# Altium schematic sheet rio.SchDoc
size A4
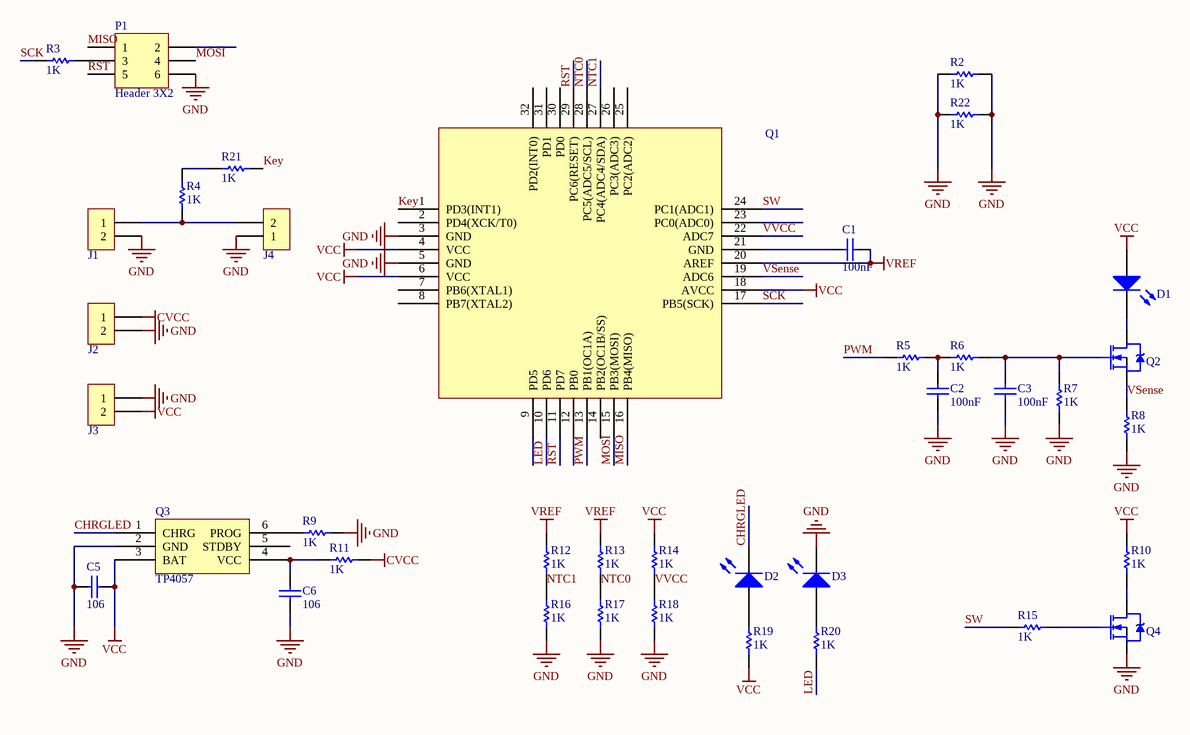
[diagram p0: rio.SchDoc]

## Parts
C1  value 100nF  [0603]  (hidden comment: Cap Semi)
C2  value 100nF  [0603]  (hidden comment: Cap Semi)
C3  value 100nF  [0603]  (hidden comment: Cap Semi)
C5  value 106  [0805]  (hidden comment: Cap Semi)
C6  value 106  [0805]  (hidden comment: Cap Semi)
D1  LED_3W  [2PIN2.0smd]  (value not drawn)
D2  LED  [0805]  (value not drawn)
D3  LED  [0805]  (value not drawn)
J1  2PIN  [4pin smd key]  (value not drawn)
J2  2PIN  [2PIN2.54 smd]  (value not drawn)
J3  2PIN  [2PIN2.54 smd]  (value not drawn)
J4  2PIN  [smd key 2pin]  (value not drawn)
P1  Header 3X2  [HDR2X3 - smd]
Q1  M8  [TQFP32]  (value not drawn)
Q2  NMOS-2  [SOT23]  (value not drawn)
Q3  TP4057  [SOT26]
Q4  NMOS-2  [SOT23]  (value not drawn)
R2  value 1K  [0805]  (hidden comment: Res Semi)
R3  value 1K  [0805]  (hidden comment: Res Semi)
R4  value 1K  [0805]  (hidden comment: Res Semi)
R5  value 1K  [0603]  (hidden comment: Res Semi)
R6  value 1K  [0603]  (hidden comment: Res Semi)
R7  value 1K  [0603]  (hidden comment: Res Semi)
R8  value 1K  [3216[1206]]  (hidden comment: Res Semi)
R9  value 1K  [0603]  (hidden comment: Res Semi)
R10  value 1K  [2PIN2.0smd]  (hidden comment: Res Semi)
R11  value 1K  [3216[1206]]  (hidden comment: Res Semi)
R12  value 1K  [0603]  (hidden comment: Res Semi)
R13  value 1K  [0603]  (hidden comment: Res Semi)
R14  value 1K  [0603]  (hidden comment: Res Semi)
R15  value 1K  [0603]  (hidden comment: Res Semi)
R16  value 1K  [2PIN2.0smd]  (hidden comment: Res Semi)
R17  value 1K  [2PIN2.0smd]  (hidden comment: Res Semi)
R18  value 1K  [0603]  (hidden comment: Res Semi)
R19  value 1K  [0603]  (hidden comment: Res Semi)
R20  value 1K  [0603]  (hidden comment: Res Semi)
R21  value 1K  [0805]  (hidden comment: Res Semi)
R22  value 1K  [0805]  (hidden comment: Res Semi)

## Nets
CVCC: J2.1 R11.2
GND: C2.1 C3.1 C5.1 C6.1 D3.2(K) J1.2 J2.2 J3.1 J4.1 P1.6 Q1.3(GND) Q1.5(GND) Q3.2(GND) Q4.3(S) R2.1 R2.2 R7.1 R8.2 R9.1 R16.1 R17.1 R18.1 R22.1 R22.2
VCC: C5.2 D1.1(A) J3.2 Q1.4(VCC) Q1.6(VCC) Q1.18(AVCC) Q3.3(BAT) R10.1 R14.1 R19.1
VREF: C1.2 Q1.20(AREF) R12.1 R13.1
CHRGLED: D2.2(K) Q3.1(CHRG)
Key: Q1.1(PD3(INT1)) R21.1
LED: Q1.10(PD6) R20.1
MISO: P1.1 Q1.16(PB4(MISO))
MOSI: P1.4 Q1.15(PB3(MOSI))
NTC0: Q1.28(PC5(ADC5/SCL)) R13.2 R17.2
NTC1: Q1.27(PC4(ADC4/SDA)) R12.2 R16.2
PWM: Q1.13(PB1(OC1A)) R5.1
RST: P1.5 Q1.11(PD7) Q1.29(PC6(RESET))
SCK: Q1.17(PB5(SCK)) R3.1
SW: Q1.24(PC1(ADC1)) R15.1
VSense: Q1.19(ADC6) Q2.3(S) R8.1
VVCC: Q1.22(ADC7) R14.2 R18.2
NetC1_1: C1.1 Q1.21(GND)
NetC2_2: C2.2 R5.2 R6.1
NetC3_2: C3.2 Q2.1(G) R6.2 R7.2
NetC6_2: C6.2 Q3.4(VCC) R11.1
NetD1_2: D1.2(K) Q2.2(D)
NetD2_1: D2.1(A) R19.2
NetD3_1: D3.1(A) R20.2
NetJ1_1: J1.1 J4.2 R4.1
NetP1_3: P1.3 R3.2
NetQ3_6: Q3.6(PROG) R9.2
NetQ4_1: Q4.1(G) R15.2
NetQ4_2: Q4.2(D) R10.2
NetR4_2: R4.2 R21.2

Not connected (* = marked no-connect by the designer): P1 2; Q1 2(PD4(XCK/T0)) 7(PB6(XTAL1)) 8(PB7(XTAL2)) 9(PD5) 12(PB0) 14(PB2(OC1B/SS)) 23(PC0(ADC0)) 25(PC2(ADC2)) 26(PC3(ADC3)) 30(PD0) 31(PD1) 32(PD2(INT0)); Q2 0; Q3 5(STDBY); Q4 0

## Library data of the parts
C1-C3 C5 C6 = Cap Semi: Capacitor (Semiconductor SIM Model); Published: 8-Jun-2000; LatestRevisionDate: 17-Jul-2002; LatestRevisionNote: Re-released for DXP Platform.; PackageReference: C1206; Publisher: Altium Limited
P1 = Header 3X2: Header, 3-Pin, Dual row; LatestRevisionDate: 17-Jul-2002; LatestRevisionNote: Re-released for DXP Platform.; Publisher: Altium Limited
Q2 Q4 = NMOS-2: N-Channel Power MOSFET; Note: Pin 2 is electrically connected to pin 4.; Published: 8-Jun-2000; LatestRevisionDate: 17-Jul-2002; LatestRevisionNote: Re-released for DXP Platform.; DatasheetDocument: PD-9.814; PackageReference: TO-220AB; Publisher: Altium Limited; Code_JEDEC: TO-220-AB; ComponentLink1Description: Manufacturer Link; ComponentLink1URL: http://www.irf.com/
R2-R22 = Res Semi: Semiconductor Resistor; Published: 8-Jun-2000; LatestRevisionDate: 17-Jul-2002; LatestRevisionNote: Re-released for DXP Platform.; PackageReference: AXIAL-0.5; Publisher: Altium Limited